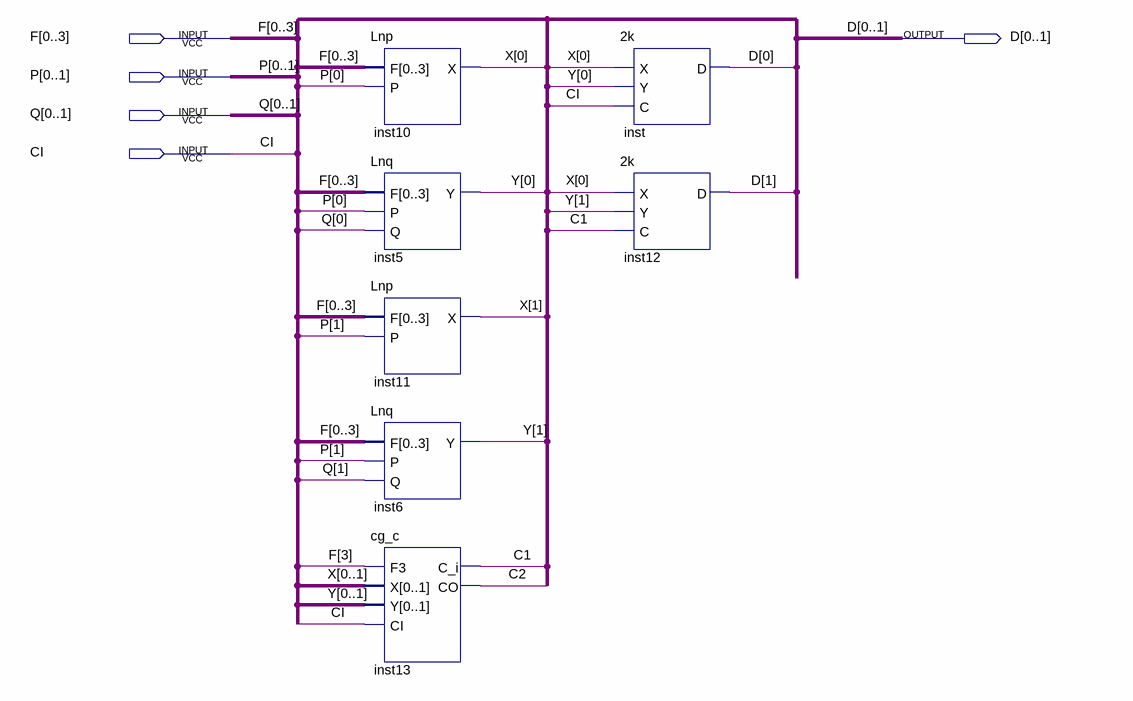
[diagram p0: schematic sheet]
// Quartus schematic lsm_c.bdf as structural Verilog: 7 symbols, 5 pins
module lsm_c (
  input  [0:3] F,
  input  [0:1] P,
  input  [0:1] Q,
  input  CI,
  output [0:1] D
);

  wire C1, C2;
  wire [1:0] X, Y;

  Lnp inst10 (.F(F), .P(P[0]), .X(X[0]));
  Lnq inst5 (.F(F), .P(P[0]), .Q(Q[0]), .Y(Y[0]));
  Lnp inst11 (.F(F), .P(P[1]), .X(X[1]));
  Lnq inst6 (.F(F), .P(P[1]), .Q(Q[1]), .Y(Y[1]));
  cg_c inst13 (.F3(F[3]), .X({X[0], X[1]}), .Y({Y[0], Y[1]}), .CI(CI), .C_i(C1), .CO(C2));
  \2k  inst (.X(X[0]), .Y(Y[0]), .C(CI), .D(D[0]));
  \2k  inst12 (.X(X[0]), .Y(Y[1]), .C(C1), .D(D[1]));
endmodule
